# EAGLE design rapidshark-butt-break-mk-1.0 (EAGLE 6.5.0)
AUTHOR: sean@yak.net
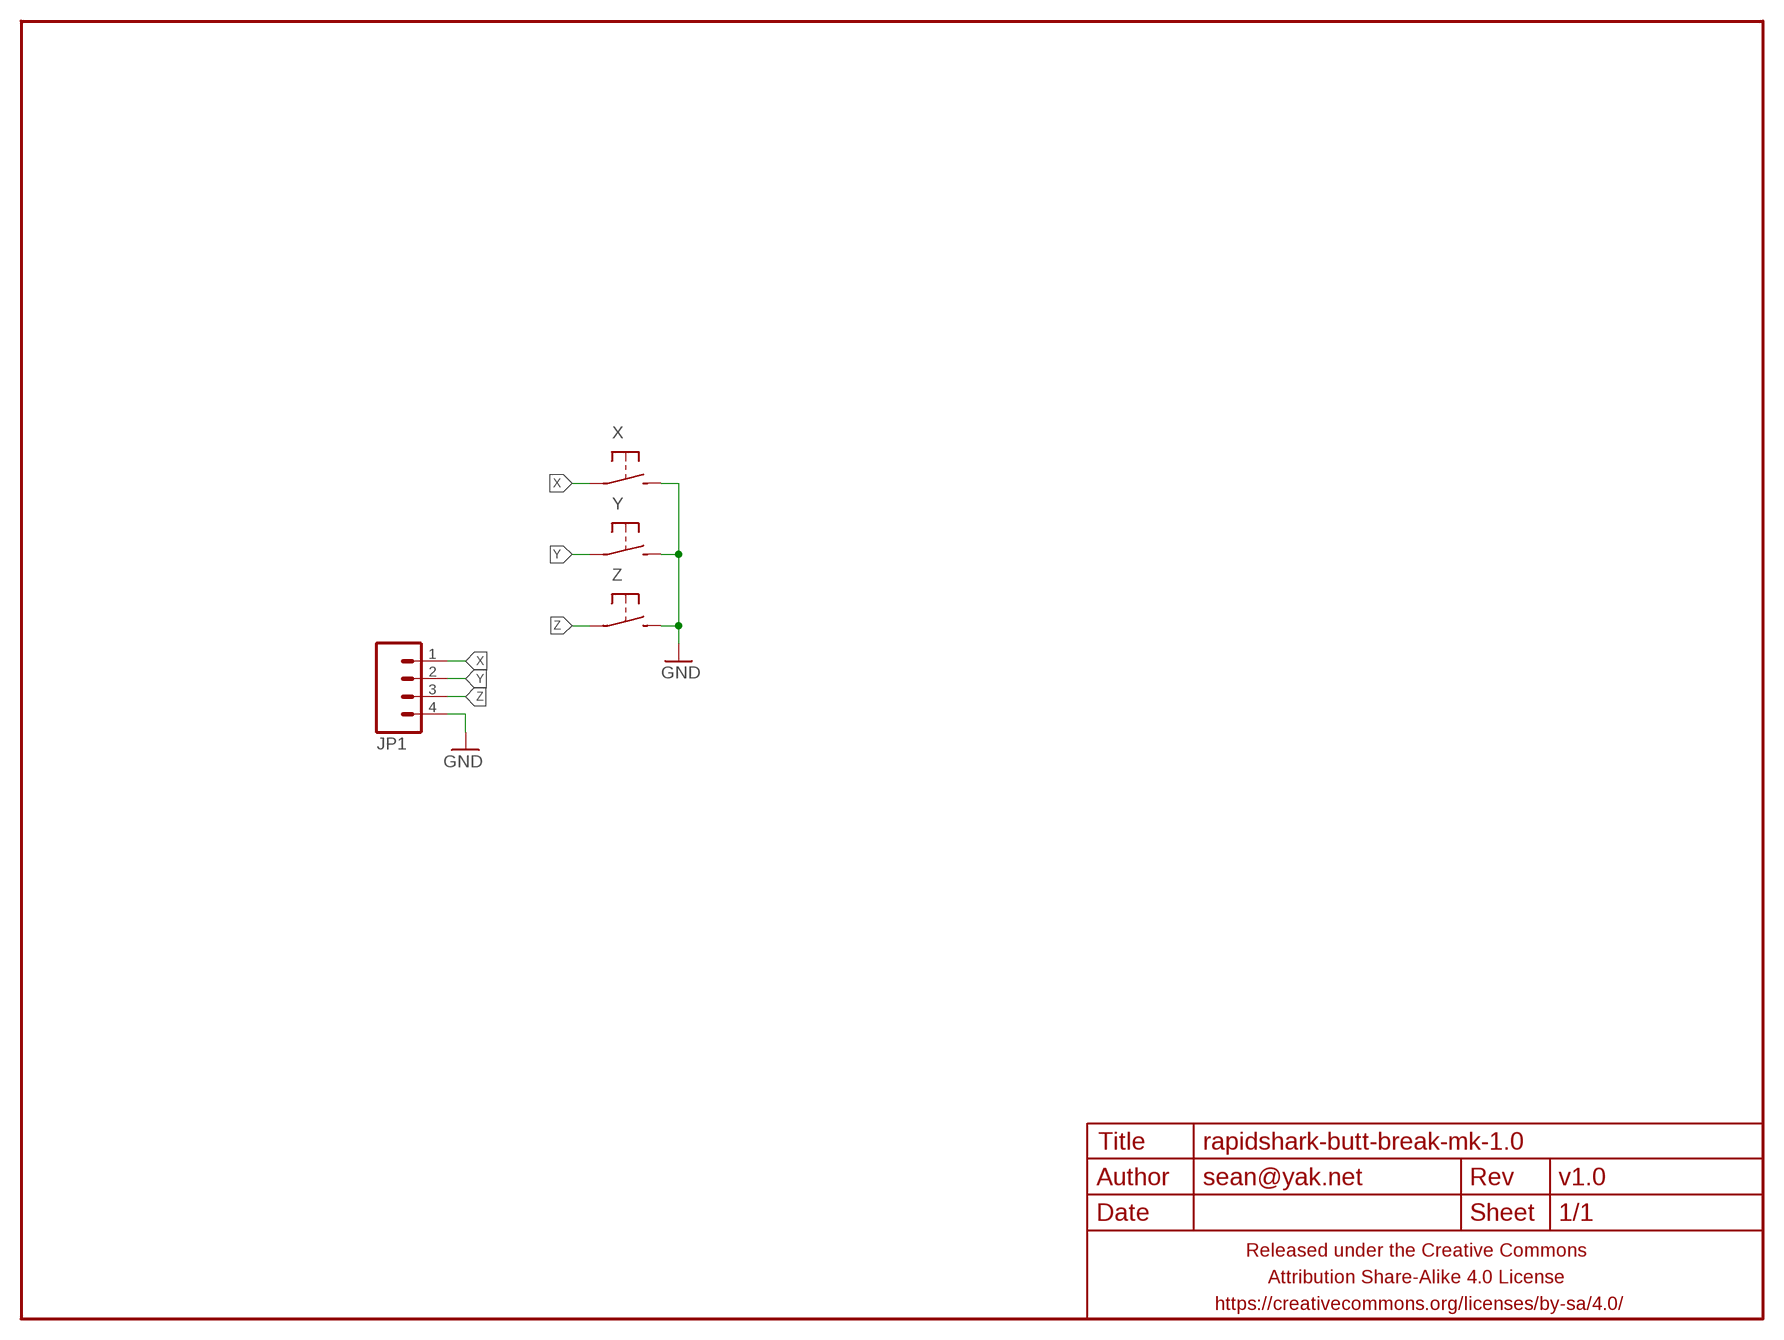
[diagram p0: schematic, sheet 1]

## Parts
FRAME1  FRAME-LETTERNO_PACKAGE  [DUMMY]
JP1  M04JST-PTH  [JST-4-PH-RA-PTH]
X  SPST-NO-TACT3MM-PTH-SMALL-PADS  [DTS-3-SMALL-PADS]
Y  SPST-NO-TACT3MM-PTH-SMALL-PADS  [DTS-3-SMALL-PADS]
Z  SPST-NO-TACT3MM-PTH-SMALL-PADS  [DTS-3-SMALL-PADS]

## Nets
GND: JP1.4 X.2 Y.2 Z.2
X: JP1.1 X.1
Y: JP1.2 Y.1
Z: JP1.3 Z.1

## Library data of the parts
FRAME1 = A_butts:FRAME-LETTER: Schematic Frame Standard 8.5x11 US Letter frame; DESIGNER: sean@yak.net; VERSION: v1.0
JP1 = A_butts:M04: Header 4 Standard 4-pin 0.1" header. Use with straight break away headers (SKU : PRT-00116), right angle break away headers (PRT-00553), swiss pins (PRT-00743), machine pins (PRT-00117), and female headers (PRT-00115). Molex polarized connector foot print use with SKU : PRT-08231 with associated crimp pins and housings. 1MM SMD Version SKU: PRT-10208; SKU: PRT-09916
X Y Z = A_butts:SPST-NO-TACT

## Board
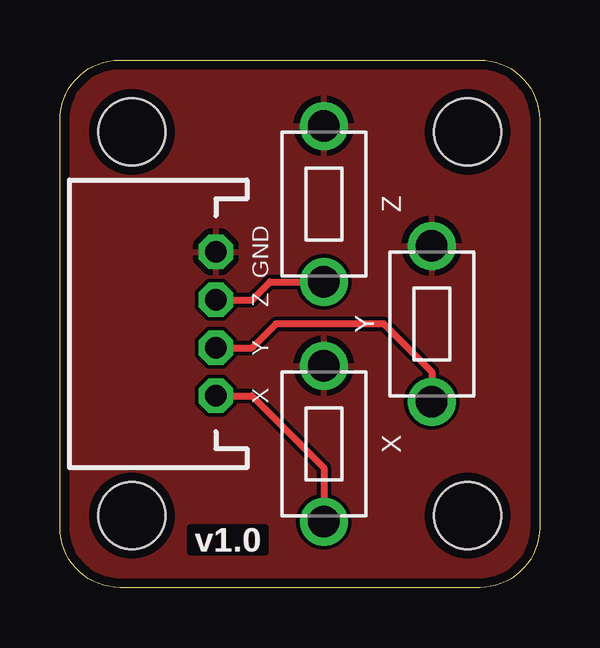
[diagram p1: board, top side]
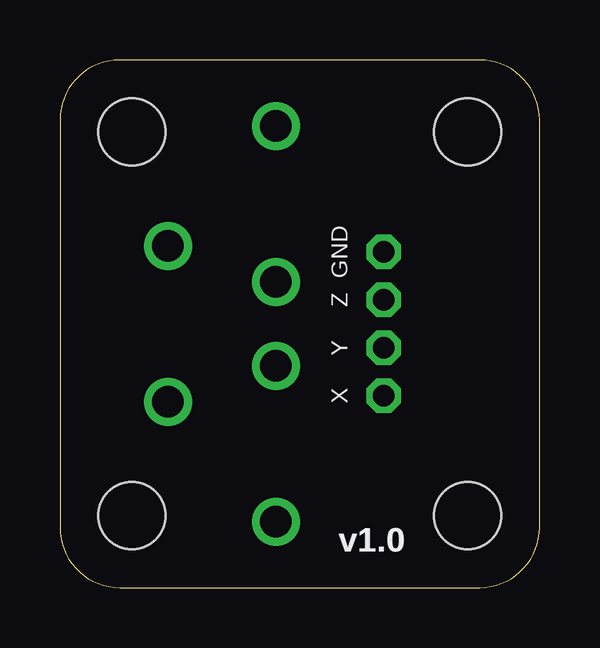
[diagram p2: board, bottom side, seen from below]

Size 20 x 22 mm. Coordinates in mm from the lower left corner, seen from the top.
Outline: 20,19.5 20,2.5 arc-90 17.5,0 2.5,0 arc-90 0,2.5 0,19.5 arc-90 2.5,22 17.5,22 arc-90 20,19.5
Copper layers (1*16): Top 0.0356mm / dielectric 1.5011mm / Bottom 0.0356mm
Design rules "LaenPCBOrder_2": minimum track width 6mil, minimum drill 13mil, track to track 6mil, track to pad 6mil, pad to pad 6mil, via to via 6mil, smd to smd 6mil, copper to edge 15mil, drill to drill 6mil, minimum pad ring 7mil, minimum via ring 7mil, stop-mask expansion 3mil, vias tented up to drill 20mil, thermal gap 10mil
Holes 2.8 mm at 3,19 3,3 17,19 17,3

### Footprints (pad centres in the part's own frame; a part is rotated, then mirrored left to right if it is on the bottom)
JST-4-PH-RA-PTH = drill 0.9 pad 1.422 octagon: 1 0,0; 2 2,0; 3 4,0; 4 6,0
DTS-3-SMALL-PADS = drill 1.3 pad 2: 1 -3.25,0; 2 3.25,0

### Placement (x,y rotation side)
FRAME1  0,0 270 bottom
JP1  6.5,8 90 top
X  11,6 90 top
Y  15.5,11 90 top
Z  11,16 90 top

### Tracks (layer width: path | path; a pad name or v marks a point on that pad's centre or on a via)
GND
  pour Top (rank 6): 20,0 0,0 0,22 20,22
X
  Top 0.3: JP1.1 8,8 11,5 X.1
Y
  Top 0.3: Y.1 15.5,9 13.5,11 9,11 8,10 JP1.2
Z
  Top 0.3: JP1.3 8,12 8.75,12.75 Z.1

### Text on the board
tPlace: GND | Z | Y | X
bPlace: GND | Z | Y | X